# EasyEDA Pro project Power Switch.eprj

# Schematic Schematic1
Board Name: Board1; Drawed: MengYang
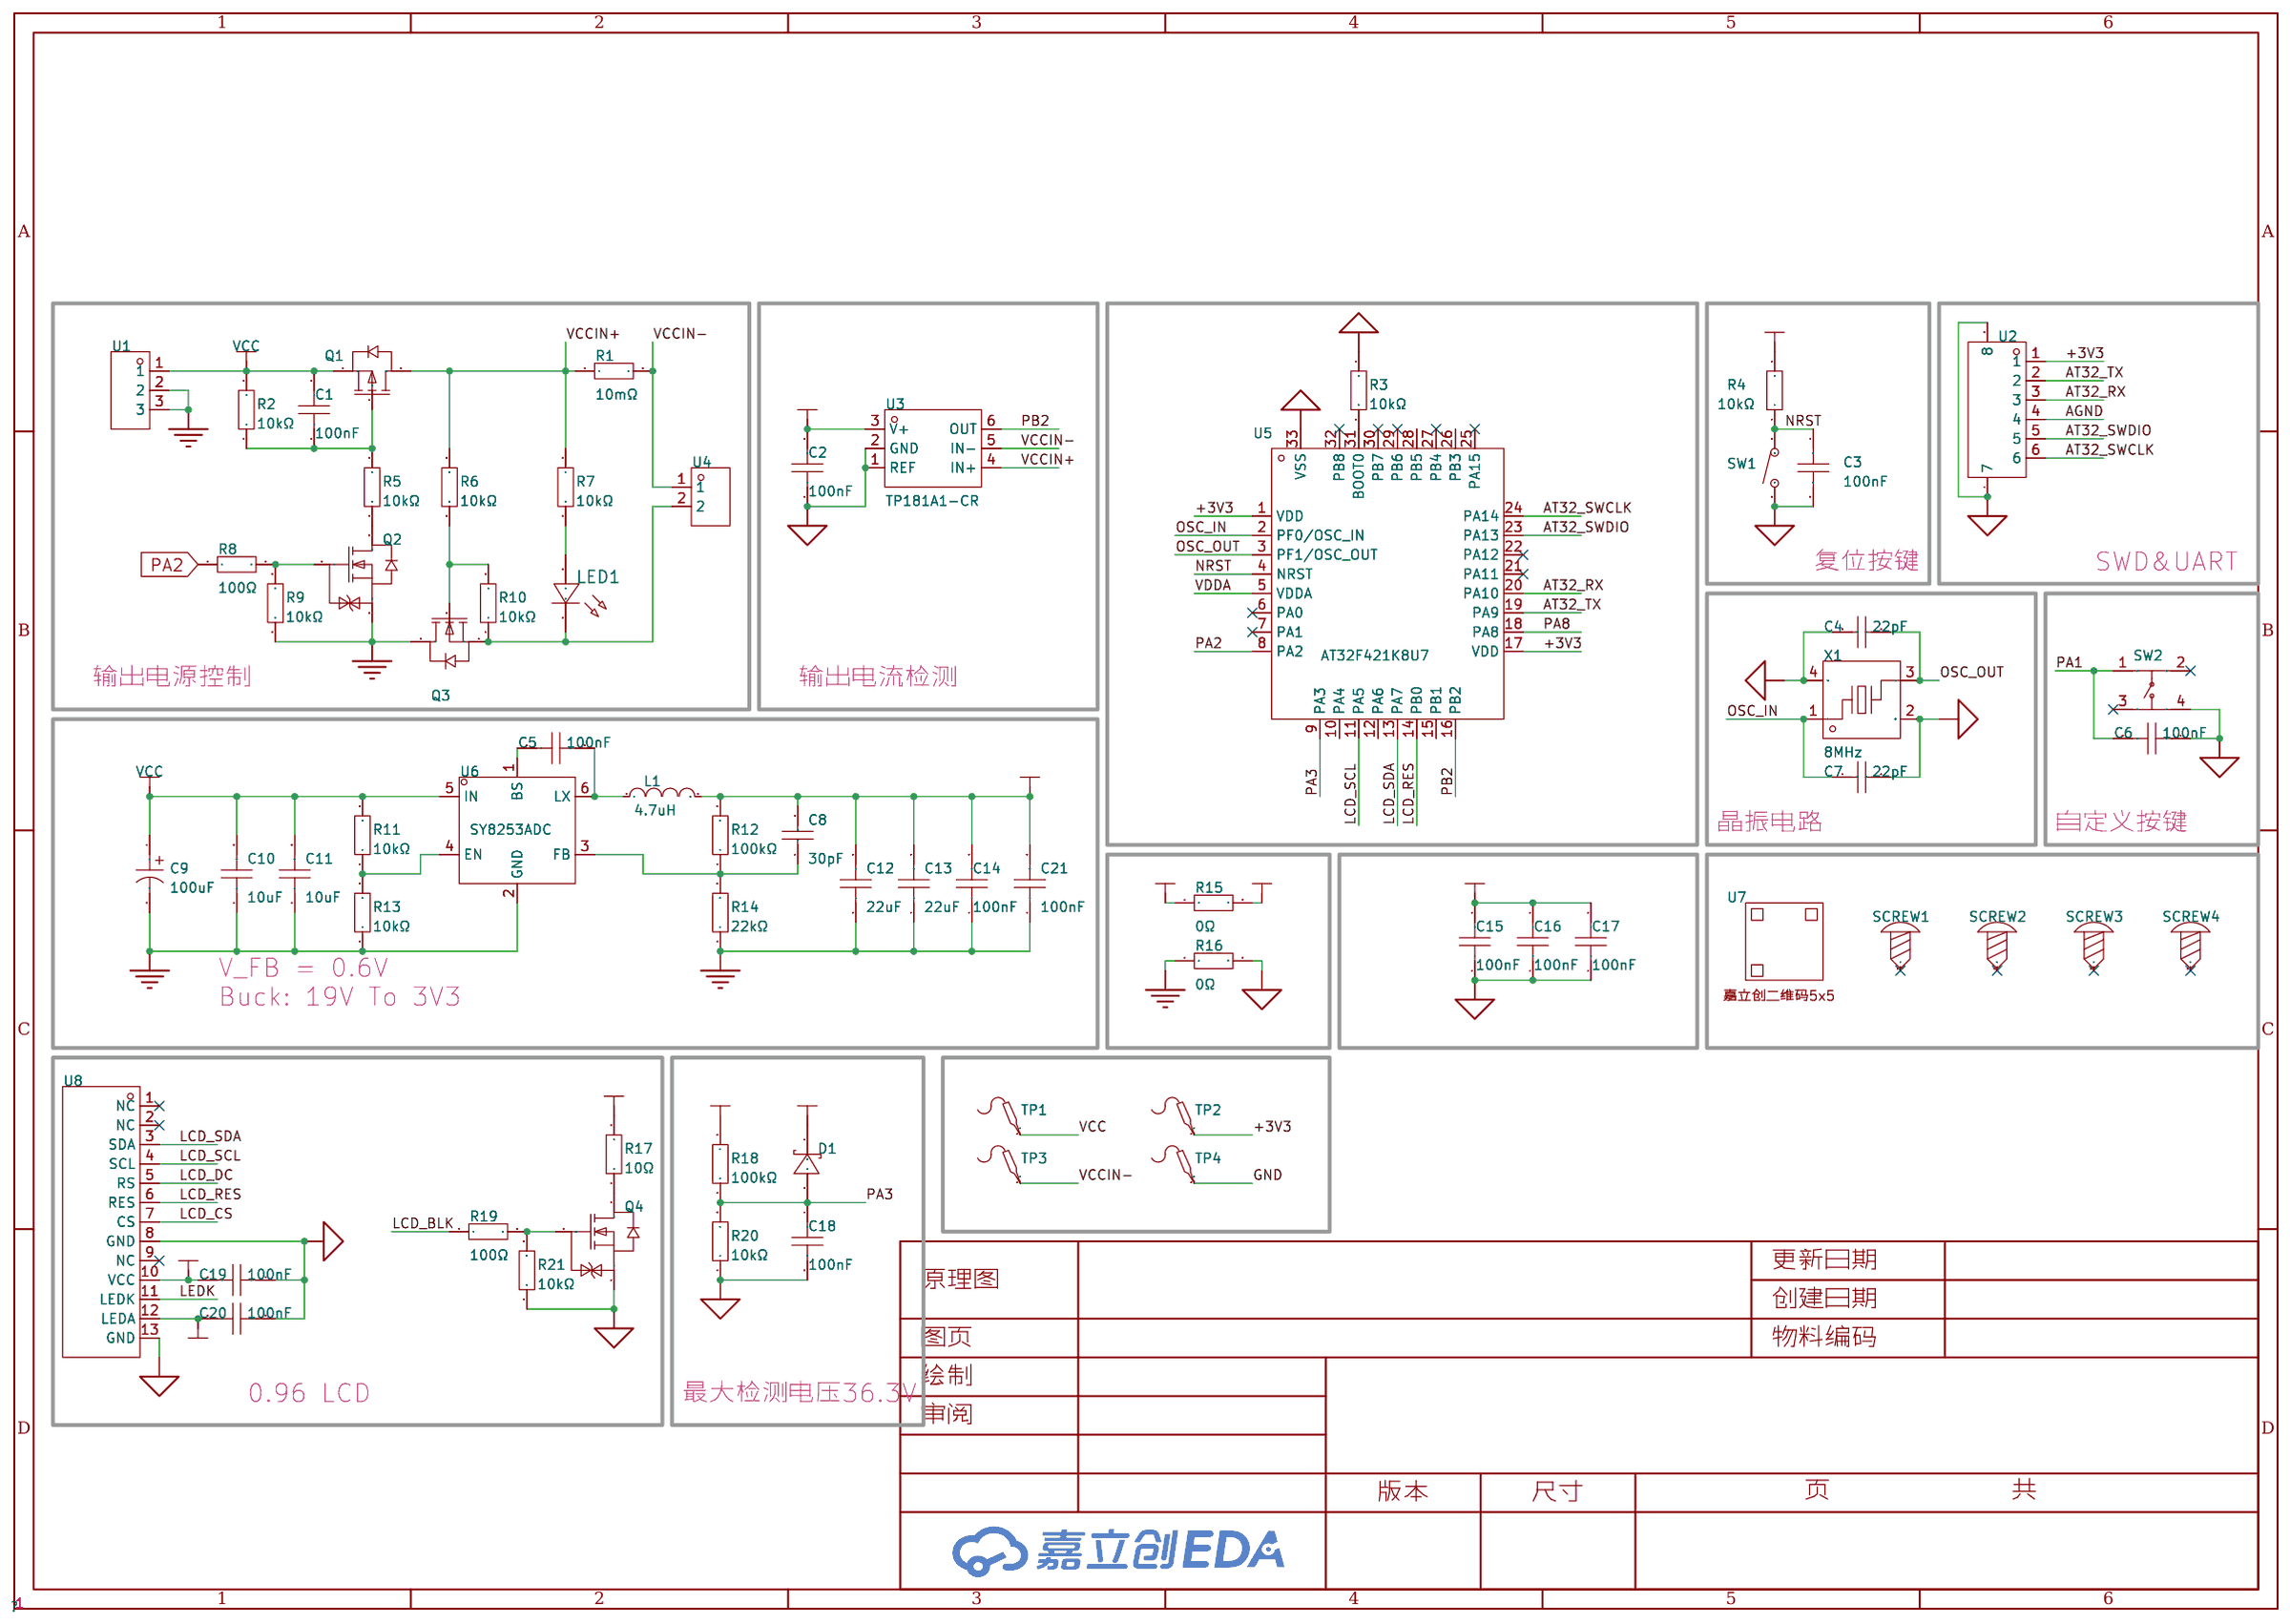
[diagram p0: schematic sheet]

## Parts
C1  100nF  [C0402]
C2  100nF  [C0402]
C3  100nF  [C0402]
C4  22pF  [C0402]
C5  100nF  [C0402]
C6  100nF  [C0402]
C7  22pF  [C0402]
C8  30pF  [C0402]
C9  100uF  [CAP-SMD_BD6.3-L6.6-W6.6-LS7.4-FD]
C10  10uF  [C0805]
C11  10uF  [C0805]
C12  22uF  [C0603]
C13  22uF  [C0603]
C14  100nF  [C0402]
C15  100nF  [C0402]
C16  100nF  [C0402]
C17  100nF  [C0402]
C18  100nF  [C0402]
C19  100nF  [C0402]
C20  100nF  [C0402]
C21  100nF  [C0402]
D1  SD103AWS  [SOD-323_L1.8-W1.3-LS2.5-RD]
L1  4.7uH  [IND-SMD_L5.4-W5.2_FXL0530]
LED1  -  [LED_0603]
Q1  NCE30P25S  [SOIC-8_L5.0-W4.0-P1.27-LS6.0-BL]
Q2  BR2N7002K2  [SOT-23-3_L2.9-W1.6-P1.90-LS2.8-BR]
Q3  NCEP4045GU  [DFN-8_L5.8-W4.9-P1.27-LS6.0-BL-1]
Q4  BR2N7002K2  [SOT-23-3_L2.9-W1.6-P1.90-LS2.8-BR]
R1  10mΩ  [R2512]
R2  10kΩ  [R0402]
R3  10kΩ  [R0402]
R4  10kΩ  [R0402]
R5  10kΩ  [R0402]
R6  10kΩ  [R0402]
R7  10kΩ  [R0402]
R8  100Ω  [R0402]
R9  10kΩ  [R0402]
R10  10kΩ  [R0402]
R11  10kΩ  [R0402]
R12  100kΩ  [R0402]
R13  10kΩ  [R0402]
R14  22kΩ  [R0402]
R15  0Ω  [R0402]
R16  0Ω  [R0402]
R17  10Ω  [R0402]
R18  100kΩ  [R0402]
R19  100Ω  [R0402]
R20  10kΩ  [R0402]
R21  10kΩ  [R0402]
SCREW1  -  [M2螺丝]  (no BOM)
SCREW2  -  [M2螺丝]  (no BOM)
SCREW3  -  [M2螺丝]  (no BOM)
SCREW4  -  [M2螺丝]  (no BOM)
SW1  TS-1185-B-A-B-A  [SW-SMD_L4.0-W3.0-LS5.0]
SW2  TS-1102S-B-C-B  [KEY-SMD_4P-L6.0-W6.0-P4.50-LS8.6]
TP1  -  [Test-Point-0.5mm]
TP2  -  [Test-Point-0.5mm]
TP3  -  [Test-Point-0.5mm]
TP4  -  [Test-Point-0.5mm]
U1  HC-DC-007B-2.5  [DC-IN-TH_HC-DC-007B-2.5]
U2  WAFER-GH1.25-6PWB  [CONN-SMD_6P-P1.25_XUNPU_WAFER-GH1.25-6PWB]
U3  TP181A1-CR  [SC70-6_L2.1-W1.3-P0.65-LS2.3-BL]
U4  KF301-5.0-2P  [CONN-TH_P5.00_KF301-5.0-2P]
U5  AT32F421K8U7  [QFN-32_L5.0-W5.0-P0.50-BL-EP3.4]
U6  SY8253ADC  [SOT-23-6_L2.9-W1.6-P0.95-LS2.8-BR]
U7  -  [JLC-QRCODE-5x5]  (no BOM)
U8  HS096T01H13  [LCD-SMD_HS096T01H13]
X1  8MHz  [OSC-SMD_4P-L3.2-W2.5-BL]

## Library data of the parts
C1-C3 C5 C6 C14-C21 = CL05B104KB54PNC: LCSC Part Name: 100nF ±10% 50V; Supplier Part: C307331; Manufacturer: SAMSUNG(三星); Supplier Footprint: 0402; JLCPCB Part Class: 基础库; Datasheet: https://atta.szlcsc.com/upload/public/pdf/source/20160218/1457707763339.pdf; Supplier: LCSC; Tolerance: ±10%; Voltage Rated: 50V; Temperature Coefficient: X7R
C4 C7 = 0402CG220J500NT: LCSC Part Name: 22pF ±5% 50V; Supplier Part: C1555; Manufacturer: FH(风华); Supplier Footprint: 0402; JLCPCB Part Class: 基础库; Datasheet: https://atta.szlcsc.com/upload/public/pdf/source/20200305/C486355_26A10D38EF8C2A5C37091D0039909270.pdf; Supplier: LCSC; Tolerance: ±5%; Voltage Rated: 50V; Temperature Coefficient: C0G
C8 = CC0402JRNPO9BN300: LCSC Part Name: 30pF ±5% 50V; Supplier Part: C107004; Manufacturer: YAGEO(国巨); Supplier Footprint: 0402; JLCPCB Part Class: 扩展库; Datasheet: https://atta.szlcsc.com/upload/public/pdf/source/20170914/C128857_1505359892143968080.pdf; Supplier: LCSC; Tolerance: ±5%; Voltage Rated: 50V; Temperature Coefficient: NP0
C9 = RVT100UF35V67RV0034: LCSC Part Name: 100uF ±20% 35V; Supplier Part: C2836442; Manufacturer: KNSCHA(科尼盛); Supplier Footprint: SMD,D6.3xL7.7mm; JLCPCB Part Class: 扩展库; Datasheet: https://atta.szlcsc.com/upload/public/pdf/source/20210528/C2836442_7F6389BF36F63F32D6DF3A507E8E95D6.pdf; Supplier: LCSC; Tolerance: ±20%; Rated Voltage: 35V; Ripple Current: 87mA@120kHz; φD: 6.3mm; L: 7.7mm; Lifetime @ Temp: 2000hrs@105℃; Operating Temperature: -55℃~+105℃
C10 C11 = CL21A106KAYNNNE_C15850: LCSC Part Name: 10uF ±10% 25V; Supplier Part: C15850; Manufacturer: SAMSUNG(三星); Manufacturer Part: CL21A106KAYNNNE; Supplier Footprint: 0805; JLCPCB Part Class: 基础库; Datasheet: https://atta.szlcsc.com/upload/public/pdf/source/20160218/1457707763339.pdf; Supplier: LCSC; Tolerance: ±10%; Voltage Rated: 25V; Temperature Coefficient: X5R
C12 C13 = CL10A226MQ8NRNC: LCSC Part Name: 22uF ±20% 6.3V; Supplier Part: C59461; Manufacturer: SAMSUNG(三星); Supplier Footprint: 0603; JLCPCB Part Class: 基础库; Datasheet: https://atta.szlcsc.com/upload/public/pdf/source/20160218/1457707763339.pdf; Supplier: LCSC; Tolerance: ±20%; Voltage Rated: 6.3V; Temperature Coefficient: X5R
D1 = SD103AWS_C181207: LCSC Part Name: 电压:40V 电流:350mA; Supplier Part: C181207; Manufacturer: Hottech(合科泰); Supplier Footprint: SOD-323; JLCPCB Part Class: 扩展库; Datasheet: https://atta.szlcsc.com/upload/public/pdf/source/20220428/0D2FA5652FCC4AF12D0418BE55C06B8A.pdf; Supplier: LCSC; Forward Voltage (Vf@If): 600mV@200mA; Reverse Voltage (Vr): 40V; Average Rectified Current (Io): 350mA
L1 = FXL0530-4R7-M: LCSC Part Name: 4.7uH ±20% 5A; Supplier Part: C177246; Manufacturer: cjiang(长江微电); Supplier Footprint: SMD,5.2x5.4mm; JLCPCB Part Class: 扩展库; Datasheet: https://atta.szlcsc.com/upload/public/pdf/source/20240426/3189EA8206330E2108542F9E34E540E7.pdf; Supplier: LCSC; Tolerance: ±20%; Rated Current: 4.5A; Saturation Current (Isat): 5A; DC Resistance (DCR): 60mΩ; Type: 一体成型电感
LED1 = LED_0603-R: Supplier Footprint: 0603
Q1 = NCE30P25S: 类型:1个P沟道;漏源电压(Vdss):30V;连续漏极电流(Id):25A;功率(Pd):3.5W;导通电阻(RDS(on)@Vgs,Id):9mΩ@10V,15A;阈值电压(Vgs(th)@Id):2.5V@250uA;; LCSC Part Name: 1个P沟道 耐压:30V 电流:25A; Supplier Part: C167517; Manufacturer: NCE(无锡新洁能); Supplier Footprint: SOIC-8; JLCPCB Part Class: 扩展库; Datasheet: https://atta.szlcsc.com/upload/public/pdf/source/20180329/C167517_14A30FD971841593E007DFD0589DD760.pdf; Supplier: LCSC; Type: 1个P沟道; Drain Source Voltage (Vdss): 30V; Continuous Drain Current (Id): 25A; Power Dissipation (Pd): 3.5W; Drain Source On Resistance (RDS(on)@Vgs,Id): 9mΩ@10V,15A; Gate Threshold Voltage (Vgs(th)@Id): 2.5V@250uA
Q2 Q4 = BR2N7002K2: 类型:1个N沟道;漏源电压(Vdss):60V;连续漏极电流(Id):300mA;功率(Pd):350mW;导通电阻(RDS(on)@Vgs,Id):1.7Ω@5V;阈值电压(Vgs(th)@Id):1.6V@250uA;; LCSC Part Name: 1个N沟道 耐压:60V 电流:300mA; Supplier Part: C358380; Manufacturer: BLUE ROCKET(蓝箭); Supplier Footprint: SOT-23; JLCPCB Part Class: 扩展库; Datasheet: https://atta.szlcsc.com/upload/public/pdf/source/20190129/C358380_0BB1AFEA822C683034D668672FCDA5F9.pdf; Supplier: LCSC; Type: 1个N沟道; Drain Source Voltage (Vdss): 60V; Continuous Drain Current (Id): 300mA; Power Dissipation (Pd): 350mW; Drain Source On Resistance (RDS(on)@Vgs,Id): 1.7Ω@5V; Gate Threshold Voltage (Vgs(th)@Id): 1.6V@250uA
Q3 = NCEP4045GU: 类型:1个N沟道;漏源电压(Vdss):40V;连续漏极电流(Id):45A;功率(Pd):28W;导通电阻(RDS(on)@Vgs,Id):6mΩ@10V,20A;阈值电压(Vgs(th)@Id):1.6V@250uA;; LCSC Part Name: 1个N沟道 耐压:40V 电流:45A; Supplier Part: C502973; Manufacturer: NCE(无锡新洁能); Supplier Footprint: DFN-8(4.9x5.8); JLCPCB Part Class: 扩展库; Datasheet: https://atta.szlcsc.com/upload/public/pdf/source/20220222/FD08EF86978BD853F9352D6B6A84BE91.pdf; Supplier: LCSC; Type: 1个N沟道; Drain Source Voltage (Vdss): 40V; Continuous Drain Current (Id): 45A; Power Dissipation (Pd): 28W; Drain Source On Resistance (RDS(on)@Vgs,Id): 6mΩ@10V,20A; Gate Threshold Voltage (Vgs(th)@Id): 1.6V@250uA; Total Gate Charge (Qg@Vgs): 17.6nC@10V; Input Capacitance (Ciss@Vds): 831pF@20V; Reverse Transfer Capacitance (Crss@Vds): 24pF@20V; Operating Temperature: -55℃~+150℃@(Tj)
R1 = FMF25FPJR010-LH_C105366: LCSC Part Name: 10mΩ ±1% 2W; Supplier Part: C105366; Manufacturer: PSA(信昌电陶); Manufacturer Part: FMF25FPJR010-LH; Supplier Footprint: 2512; JLCPCB Part Class: 扩展库; Datasheet: https://atta.szlcsc.com/upload/public/pdf/source/20191129/C464975_5F7F8E27A15B862FFEA0BACE05AA9473.pdf; Supplier: LCSC; Tolerance: ±1%; Power(Watts): 2W; Temperature Coefficient: ±70ppm/℃
R2-R7 R9-R11 R13 R20 R21 = 0402WGF1002TCE: LCSC Part Name: 10kΩ ±1% 62.5mW 厚膜电阻; Supplier Part: C25744; Manufacturer: UNI-ROYAL(厚声); Supplier Footprint: 0402; JLCPCB Part Class: 基础库; Datasheet: https://atta.szlcsc.com/upload/public/pdf/source/20200306/C422600_1E6D84923E4A46A82E41ADD87F860B5C.pdf; Supplier: LCSC; Type: 厚膜电阻; Tolerance: ±1%; Power(Watts): 62.5mW; Overload Voltage (Max): 50V; Temperature Coefficient: ±100ppm/℃; Operating Temperature Range: -55℃~+155℃
R8 R19 = 0402WGF1000TCE: 电阻类型:厚膜电阻;阻值:100Ω;精度:±1%;功率:62.5mW;最大工作电压:50V;温度系数:±200ppm/℃;; LCSC Part Name: 100Ω ±1% 62.5mW 厚膜电阻; Supplier Part: C25076; Manufacturer: UNI-ROYAL(厚声); Supplier Footprint: 0402; JLCPCB Part Class: 基础库; Datasheet: https://atta.szlcsc.com/upload/public/pdf/source/20200306/C422600_1E6D84923E4A46A82E41ADD87F860B5C.pdf; Supplier: LCSC; Type: 厚膜电阻; Tolerance: ±1%; Power(Watts): 62.5mW; Overload Voltage (Max): 50V; Temperature Coefficient: ±200ppm/℃; Operating Temperature Range: -55℃~+155℃
R12 R18 = 0402WGF1003TCE: LCSC Part Name: 100kΩ ±1% 62.5mW 厚膜电阻; Supplier Part: C25741; Manufacturer: UNI-ROYAL(厚声); Supplier Footprint: 0402; JLCPCB Part Class: 基础库; Datasheet: https://atta.szlcsc.com/upload/public/pdf/source/20200306/C422600_1E6D84923E4A46A82E41ADD87F860B5C.pdf; Supplier: LCSC; Type: 厚膜电阻; Tolerance: ±1%; Power(Watts): 62.5mW; Overload Voltage (Max): 50V; Temperature Coefficient: ±100ppm/℃; Operating Temperature Range: -55℃~+155℃
R14 = 0402WGF2202TCE: LCSC Part Name: 22kΩ ±1% 62.5mW 厚膜电阻; Supplier Part: C25768; Manufacturer: UNI-ROYAL(厚声); Supplier Footprint: 0402; JLCPCB Part Class: 基础库; Datasheet: https://atta.szlcsc.com/upload/public/pdf/source/20200306/C422600_1E6D84923E4A46A82E41ADD87F860B5C.pdf; Supplier: LCSC; Type: 厚膜电阻; Tolerance: ±1%; Power(Watts): 62.5mW; Overload Voltage (Max): 50V; Temperature Coefficient: ±100ppm/℃; Operating Temperature Range: -55℃~+155℃
R15 R16 = 0402WGF0000TCE: 电阻类型:厚膜电阻;阻值:0Ω;精度:±1%;功率:62.5mW;最大工作电压:50V;温度系数:±800ppm/℃;; LCSC Part Name: 0Ω ±1% 62.5mW 厚膜电阻; Supplier Part: C17168; Manufacturer: UNI-ROYAL(厚声); Supplier Footprint: 0402; JLCPCB Part Class: 基础库; Datasheet: https://atta.szlcsc.com/upload/public/pdf/source/20200306/C422600_1E6D84923E4A46A82E41ADD87F860B5C.pdf; Supplier: LCSC; Type: 厚膜电阻; Tolerance: ±1%; Power(Watts): 62.5mW; Overload Voltage (Max): 50V; Temperature Coefficient: ±800ppm/℃; Operating Temperature Range: -55℃~+155℃
R17 = 0402WGF100JTCE: 电阻类型:厚膜电阻;阻值:10Ω;精度:±1%;功率:62.5mW;最大工作电压:50V;温度系数:±200ppm/℃;; LCSC Part Name: 10Ω ±1% 62.5mW 厚膜电阻; Supplier Part: C25077; Manufacturer: UNI-ROYAL(厚声); Supplier Footprint: 0402; JLCPCB Part Class: 基础库; Datasheet: https://atta.szlcsc.com/upload/public/pdf/source/20200306/C422600_1E6D84923E4A46A82E41ADD87F860B5C.pdf; Supplier: LCSC; Type: 厚膜电阻; Tolerance: ±1%; Power(Watts): 62.5mW; Overload Voltage (Max): 50V; Temperature Coefficient: ±200ppm/℃; Operating Temperature Range: -55℃~+155℃
SCREW1-SCREW4 = M2螺丝: Supplier Footprint: 插件
SW1 = TS-1185-B-A-B-A: 电路结构:单刀单掷;按钮形状:圆形按钮;作用力:160gf;安装方式:立贴;开关长度:4mm;开关宽度:3mm;开关高度:2mm;带支架:不带;触点电流:50mA;额定电压(DC):12V;绝缘电阻:-;带灯:无;机械寿命:10万次;; LCSC Part Name: 4*3*2mm 立贴 轻触开关; Supplier Part: C561517; Manufacturer: XKB Connectivity(中国星坤); Supplier Footprint: SMD; JLCPCB Part Class: 扩展库; Datasheet: https://atta.szlcsc.com/upload/public/pdf/source/20211011/C2F26DC0AE1820400F54DBF49644F5A1.pdf; Supplier: LCSC; Circuit: 单刀单掷; Actuator Style: 圆形按钮; Operating Force: 160gf; Mounting Style: 立贴; Switch Length: 4mm; Switch Width: 3mm; Switch Height: 2mm; Strike Gundam: 不带; Contact Current: 50mA; Voltage Rating (DC): 12V; Actuator/Cap Color: 黑色; With Lamp: 无; Mechanical Life: 10万次; Operating Temperature: -30℃~+85℃
SW2 = TS-1102S-B-C-B: LCSC Part Name: 6*6*5mm 立贴 轻触开关; Supplier Part: C480271; Manufacturer: XKB Connectivity(中国星坤); Supplier Footprint: SMD; JLCPCB Part Class: 扩展库; Datasheet: https://atta.szlcsc.com/upload/public/pdf/source/20211011/2711A6933F86C308D94098377C07E7B1.pdf; Supplier: LCSC; Circuit: 单刀单掷; Actuator Style: 圆形按钮; Operating Force: 160gf; Mounting Style: 立贴; Switch Length: 6mm; Switch Width: 6mm; Switch Height: 5mm; Strike Gundam: 不带; Contact Current: 50mA; Voltage Rating (DC): 12V; Actuator/Cap Color: 黑色; With Lamp: 无; Mechanical Life: 30万次; Operating Temperature: -20℃~+70℃
TP1-TP4 = Test-Point
U1 = HC-DC-007B-2.5: LCSC Part Name: DC电源插座 内径:2.5mm 外径:6.45mm; Supplier Part: C3010538; Manufacturer: HCTL(华灿天禄); Supplier Footprint: 插件; JLCPCB Part Class: 扩展库; Datasheet: https://atta.szlcsc.com/upload/public/pdf/source/20230915/8C7BE09142C4C7906C99972591413B87.pdf; Supplier: LCSC; Connector Type: DC电源插座; Mounting Style: 弯插; Inside Contact Diameter: 2.5mm; Outside Contact Diameter: 6.45mm; Current Rating (Max): 8A; Voltage Rating (Max): 24V; Contact Material: 黄铜; Contact Plating: 锡; Operating Temperature Range: -30℃~+70℃
U2 = WAFER-GH1.25-6PWB: 插针结构:1x6P;间距:1.25mm;安装方式:卧贴;参考系列:GH;总PIN数:6P;排数:1;每排PIN数:6;额定电流:1A;工作温度范围:-25℃~+85℃;; LCSC Part Name: 1x6P 间距:1.25mm 卧贴 系列:GH; Supplier Part: C3029381; Manufacturer: XUNPU(讯普); Supplier Footprint: SMD,P=1.25mm,卧贴; JLCPCB Part Class: 扩展库; Datasheet: https://atta.szlcsc.com/upload/public/pdf/source/20220527/CB8773BFB0913C3B8ABD62CB38BA101A.pdf; Supplier: LCSC; Pins Structure: 1x6P; Pitch: 1.25mm; Mounting Style: 卧贴; Reference Series: GH; Number of Pins: 6P; Number of Rows: 1; Number of PINs Per Row: 6; Current Rating (Max): 1A; Operating Temperature Range: -25℃~+85℃
U3 = TP181A1-CR: Supplier Part: C2902349; Manufacturer: 3PEAK; Supplier Footprint: SC70-6; JLCPCB Part Class: 扩展库; Datasheet: https://atta.szlcsc.com/upload/public/pdf/source/20230301/6D62DABF8769A8088870FFE026FF2C6D.pdf; Supplier: LCSC
U4 = KF301-5.0-2P: 结构:1x2P;间距:5mm;颜色:蓝色;安装方式:直插;额定电流:17A;额定电压:250V;排数:1;线规 - AWG:14~22;线规 - 平方毫米:1.5;每排PIN数:2;工作温度范围:-30℃~+120℃;; LCSC Part Name: 5mm 1x2P 排数:1 每排P数:2 直插; Supplier Part: C474881; Manufacturer: KEFA(科发); Supplier Footprint: 插件,P=5mm; JLCPCB Part Class: 扩展库; Datasheet: https://atta.szlcsc.com/upload/public/pdf/source/20230317/03A5B5FC229D6F9225E8F51DA1A4E80A.pdf; Supplier: LCSC; Structure: 1x2P; Pitch: 5mm; Color: 蓝色; Mounting Style: 直插; Current Rating (Max): 17A; Voltage Rating (Max): 250V; Number of Pins: 2P; Number of Rows: 1; Wire Gauge - AWG: 14~22; Wire Gauge - mm2: 1.5; Number of PINs Per Row: 2; Operating Temperature Range: -30℃~+120℃
U5 = AT32F421K8U7: Supplier Part: C2965611; Manufacturer: ARTERY(雅特力); Supplier Footprint: QFN-32; JLCPCB Part Class: 扩展库; Supplier: LCSC
U6 = SY8253ADC: 功能类型:降压型;输入电压:-;输出电流(最大值):-;; Supplier Part: F; Manufacturer: silergy(矽力杰); Supplier Footprint: SOT-23-6; JLCPCB Part Class: 扩展库; Datasheet: https://atta.szlcsc.com/upload/public/pdf/source/20180625/C93736_E75EC6FD4320D65590D2D5BF0D8B8959.pdf; Supplier: LCSC; Function: 降压型; Switch tube (built-in/external): 内置
U7 = 嘉立创二维码5x5
U8 = HS096T01H13: 主控芯片:ST7735;尺寸(inch):0.96;; LCSC Part Name: 0.96寸 0.96寸80x160(RGB)彩色SPI串口TFT液晶显示屏; Supplier Part: C18198246; Manufacturer: HS(汉昇); JLCPCB Part Class: Extended Part; Datasheet: https://atta.szlcsc.com/upload/public/pdf/source/20230921/67AD52EDFD5E8BFFA1AE424F3A3F761A.pdf; Supplier: LCSC; Main Control Chip: ST7735; Size: 0.96; Operating Temperature: -20℃~+70℃
X1 = X32258MOB4SI: LCSC Part Name: 8MHz ±10ppm 12pF; Supplier Part: C2682775; Manufacturer: YXC(扬兴晶振); Supplier Footprint: SMD3225-4P; JLCPCB Part Class: 扩展库; Datasheet: https://atta.szlcsc.com/upload/public/pdf/source/20240329/19D5F850207469550BEB00D7DFEDBC7A.pdf; Supplier: LCSC; Crystal Type: 贴片晶振; Normal temperature Frequency Tolerance: ±10ppm; External load capacitor: 12pF; Frequency Stability(Full temperature range): ±20ppm; Equivalent Series Resistance (ESR): 150Ω; Operating Temperature: -40℃~+85℃

## Nets
+3V3: C2.2 C8.2 C12.2 C13.2 C14.2 C15.2 C16.2 C17.2 C19.2 C20.2 C21.2 D1.1(C) L1.2 R4.2 R12.2 R15.1 TP2.1 U2.1 U3.3(V+) U5.1(VDD) U5.17(VDD) U8.10(VCC) U8.12(LEDA)
AGND: C2.1 C3.2 C4.1 C6.1 C7.2 C15.1 C16.1 C17.1 C18.2 C19.1 C20.1 Q4.2(S) R3.1 R16.2 R20.1 R21.1 SW1.2 SW2.4 U2.4 U2.7 U2.8 U3.1(REF) U3.2(GND) U5.33(VSS) U8.8(GND) U8.13(GND) X1.2(GND) X1.4(GND)
GND: C9.2 C10.1 C11.1 C12.1 C13.1 C14.1 C21.1 Q2.2(S) Q3.3(D) R9.1 R13.1 R14.1 R16.1 TP4.1 U1.2 U1.3 U6.2(GND)
VCC: C1.2 C9.1 C10.2 C11.2 Q1.3(S) R2.2 R11.2 TP1.1 U1.1 U6.5(IN)
VCCIN+: Q1.2(D) R1.1 R6.2 R7.2 U3.4(IN+)
VCCIN-: R1.2 R18.2 TP3.1 U3.5(IN-) U4.1
VDDA: R15.2 U5.5(VDDA)
AT32_RX: U2.3 U5.20(PA10)
AT32_SWCLK: U2.6 U5.24(PA14)
AT32_SWDIO: U2.5 U5.23(PA13)
AT32_TX: U2.2 U5.19(PA9)
LCD_BLK: R19.1
LCD_CS: U8.7(CS)
LCD_DC: U8.5(RS)
LCD_RES: U5.14(PB0) U8.6(RES)
LCD_SCL: U5.11(PA5) U8.4(SCL)
LCD_SDA: U5.13(PA7) U8.3(SDA)
LEDK: R17.2 U8.11(LEDK)
NRST: C3.1 R4.1 SW1.1 U5.4(NRST)
OSC_IN: C7.1 U5.2(PF0/OSC_IN) X1.1
OSC_OUT: C4.2 U5.3(PF1/OSC_OUT) X1.3
PA1: C6.2 SW2.1
PA2: R8.1 U5.8(PA2)
PA3: C18.1 D1.2(A) R18.1 R20.2 U5.9(PA3)
PA8: U5.18(PA8)
PB2: U3.6(OUT) U5.16(PB2)
$1N3514: C5.1 U6.1(BS)
$1N3518: C5.2 L1.1 U6.6(LX)
$1N3743: C8.1 R12.1 R14.2 U6.3(FB)
$1N4987: R11.1 R13.2 U6.4(EN)
$1N9912: Q3.1(G) R6.1 R10.2
$1N10537: C1.1 Q1.1(G) R2.1 R5.2
$1N10666: Q2.3(D) R5.1
$1N10742: Q2.1(G) R8.2 R9.2
$1N11033: LED1.2(A) R7.1
$1N11315: LED1.1(C) Q3.2(S) R10.1 U4.2
$1N15037: Q4.1(G) R19.2 R21.2
$1N15095: Q4.3(D) R17.1
$1N30434: R3.2 U5.31(BOOT0)

Not connected (* = marked no-connect by the designer): SCREW1 1*; SCREW2 1*; SCREW3 1*; SCREW4 1*; SW2 2* 3*; U5 6(PA0)* 7(PA1)* 10(PA4) 12(PA6) 15(PB1) 21(PA11)* 22(PA12)* 25(PA15)* 26(PB3) 27(PB4)* 28(PB5) 29(PB6)* 30(PB7)* 32(PB8)*; U8 1(NC)* 2(NC)* 9(NC)*

## Notes on the sheet
- 复位按键
- SWD&UART
- 输出电源控制
- 输出电流检测
- 晶振电路
- 自定义按键
- V_FB = 0.6V
  Buck: 19V To 3V3
- 0.96 LCD
- 最大检测电压36.3V

# Board PCB1
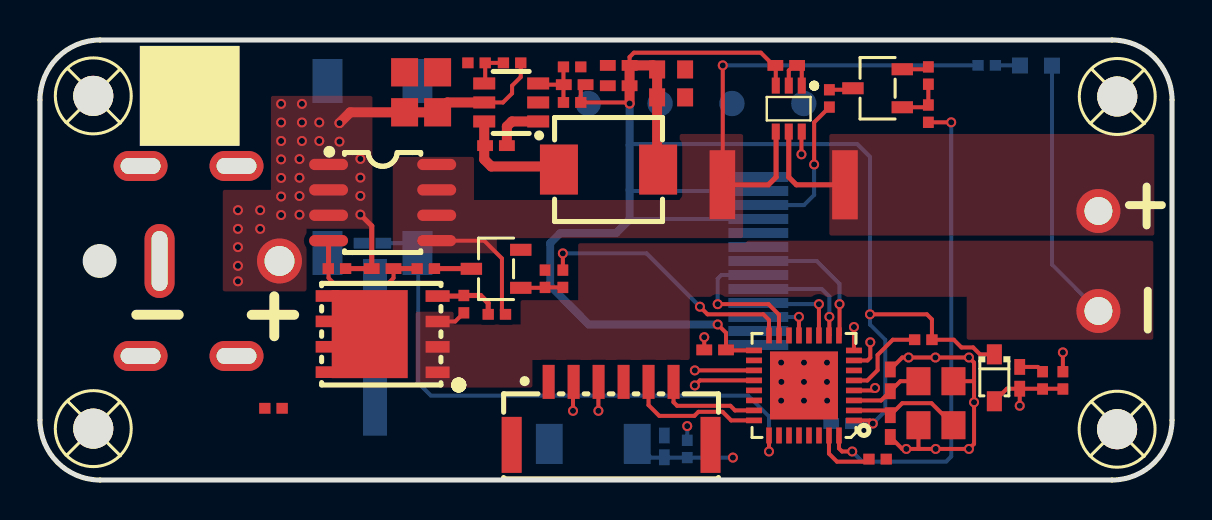
[diagram p1: board, top side]
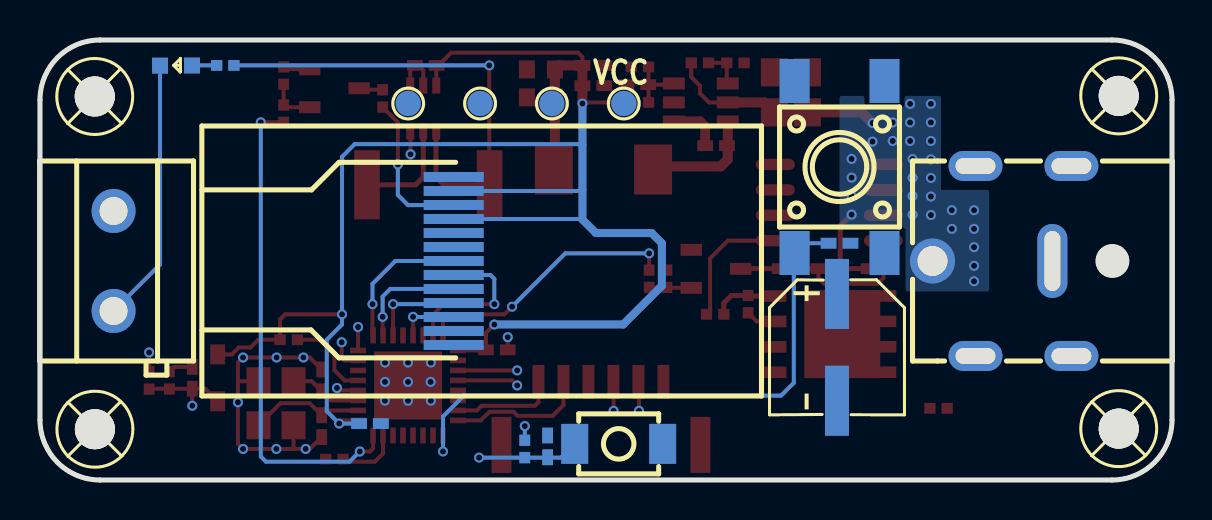
[diagram p2: board, bottom side, seen from below]

Outline 56.64 x 22 mm; copper layers: Top Layer, Inner1, Inner2, Bottom Layer. Coordinates in mm from the lower left corner of the outline.
Outline path: 0,19 0,3 arc(0.88,0.88) 3,0 53.64,0 arc(55.76,0.88) 56.64,3 56.64,19 arc(55.76,21.12) 53.64,22 3,22 arc(0.88,21.12) 0,19
Stack: Top Layer 0.035mm 外层铜厚1oz / Dielectric1 0.2104mm 7628 RC49% 8.6mil / Inner1 0.0152mm 内层铜厚 / Dielectric2 1.065mm 1.1mm H/HOZ Copper / Inner2 0.0152mm 内层铜厚 / Dielectric3 0.2104mm 7628 RC49% 8.6mil / Bottom Layer 0.035mm 外层铜厚1oz

## Design rules (mm)
template: 自定义配置
spacing copperThickness1oz (default): track to track 0.102, other pairs 0.152 to 0.3
spacing copperThickness2oz: track to track 0.203, other pairs 0.152 to 0.3
track width copperThickness1oz (default): min 0.127, default 0.201, max 2.54
track width copperThickness2oz: min 0.203, default 0.254, max 2.54
differential pair differentialPair (default): width min 0.127, default 0.254, max 2.54; gap min 0.152, default 0.152
via viaSize (default): diameter min 0.5, default 0.5, max 10; hole min 0.3, default 0.305, max 6.299

## Placement (name value [footprint] x y rotation side)
C1  100nF  [C0402]  17.14 10.57 180 top
C2  100nF  [C0402]  37.34 20.73 180 top
C3  100nF  [C0402]  31.24 1.68 90 bottom
C4  22pF  [C0402]  42.55 4.98 270 top
C5  100nF  [C0402]  22.82 16.72 180 top
C6  100nF  [C0402]  16.64 11.84 0 bottom
C7  22pF  [C0402]  42.55 2.7 270 top
C8  30pF  [C0402]  26.75 19.77 0 top
C9  100uF  [CAP-SMD_BD6.3-L6.6-W6.6-LS7.4-FD]  16.76 6.63 270 bottom
C10  10uF  [C0805]  19.89 19.38 270 top
C11  10uF  [C0805]  18.24 19.38 270 top
C12  22uF  [C0603]  31.58 20.53 180 top
C13  22uF  [C0603]  31.58 19.13 180 top
C14  100nF  [C0402]  28.96 20.73 0 top
C15  100nF  [C0402]  40.13 2.82 0 bottom
C16  100nF  [C0402]  33.78 6.51 0 top
C18  100nF  [C0402]  49.02 5.11 90 top
C21  100nF  [C0402]  28.96 19.71 0 top
D1  SD103AWS  [SOD-323_L1.8-W1.3-LS2.5-RD]  47.75 5.11 270 top
L1  4.7uH  [IND-SMD_L5.4-W5.2_FXL0530]  28.45 15.52 0 top
LED1  -  [LED_0603]  49.78 20.73 180 bottom
Q1  NCE30P25S  [SOIC-8_L5.0-W4.0-P1.27-LS6.0-BL]  17.14 13.87 270 top
Q2  BR2N7002K2  [SOT-23-3_L2.9-W1.6-P1.90-LS2.8-BR]  22.82 10.56 0 top
Q3  NCEP4045GU  [DFN-8_L5.8-W4.9-P1.27-LS6.0-BL-1]  17.14 7.29 90 top
Q4  BR2N7002K2  [SOT-23-3_L2.9-W1.6-P1.90-LS2.8-BR]  41.91 19.59 0 top
R1  10mΩ  [R2512]  37.21 14.76 0 top
R2  10kΩ  [R0402]  14.86 10.57 0 top
R3  10kΩ  [R0402]  41.91 1.05 180 top
R4  10kΩ  [R0402]  32.39 1.55 90 bottom
R5  10kΩ  [R0402]  19.3 10.57 180 top
R6  10kΩ  [R0402]  22.86 8.28 0 top
R7  10kΩ  [R0402]  47.37 20.73 180 bottom
R8  100Ω  [R0402]  26.16 10.06 270 top
R9  10kΩ  [R0402]  25.27 10.06 270 top
R10  10kΩ  [R0402]  21.21 8.79 90 top
R11  10kΩ  [R0402]  23.62 20.86 0 top
R12  100kΩ  [R0402]  26.63 18.88 0 top
R13  10kΩ  [R0402]  21.84 20.86 0 top
R14  22kΩ  [R0402]  26.63 20.66 180 top
R15  0Ω  [R0402]  44.2 7.01 180 top
R16  0Ω  [R0402]  11.68 3.58 0 top
R17  10Ω  [R0402]  39.5 19.08 270 top
R18  100kΩ  [R0402]  51.18 4.98 90 top
R19  100Ω  [R0402]  44.45 18.32 90 top
R20  10kΩ  [R0402]  50.17 4.98 270 top
R21  10kΩ  [R0402]  44.45 20.22 270 top
SCREW1  -  [M2螺丝]  53.89 2.54 0 top
SCREW2  -  [M2螺丝]  53.9 19.18 0 top
SCREW3  -  [M2螺丝]  2.67 2.57 0 top
SCREW4  -  [M2螺丝]  2.67 19.21 0 top
SW1  TS-1185-B-A-B-A  [SW-SMD_L4.0-W3.0-LS5.0]  27.69 1.81 180 bottom
SW2  TS-1102S-B-C-B  [KEY-SMD_4P-L6.0-W6.0-P4.50-LS8.6]  16.64 15.65 90 bottom
TP1  -  [Test-Point-0.5mm]  27.43 18.82 180 bottom
TP2  -  [Test-Point-0.5mm]  31.03 18.82 180 bottom
TP3  -  [Test-Point-0.5mm]  38.22 18.82 180 bottom
TP4  -  [Test-Point-0.5mm]  34.62 18.82 180 bottom
U1  HC-DC-007B-2.5  [dc-in-th_hc-dc-007b-2.5]  8.51 10.95 0 bottom
U2  WAFER-GH1.25-6PWB  [CONN-SMD_6P-P1.25_XUNPU_WAFER-GH1.25-6PWB]  28.58 3.33 0 top
U3  TP181A1-CR  [SC70-6_L2.1-W1.3-P0.65-LS2.3-BL]  37.47 18.57 180 top
U4  KF301-5.0-2P  [CONN-TH_P5.00_KF301-5.0-2P]  52.96 10.95 270 bottom
U5  AT32F421K8U7  [QFN-32_L5.0-W5.0-P0.50-BL-EP3.4]  38.23 4.73 90 top
U6  SY8253ADC  [SOT-23-6_L2.9-W1.6-P0.95-LS2.8-BR]  23.58 18.88 0 top
U7  -  [JLC-QRCODE-5x5]  7.49 19.21 0 top
U8  HS096T01H13  [LCD-SMD_HS096T01H13]  35.94 10.95 0 bottom
X1  8MHz  [OSC-SMD_4P-L3.2-W2.5-BL]  44.83 3.84 90 top

## Footprints (pads in the part's own frame, mm; a bottom-side part is the same pattern mirrored in y, then rotated)
C0402
  rect 0.79x0.54 smd: 1(-0.545,0) 2(0.545,0)
C0603
  rect 0.8x0.9 smd: 1(-0.7,0) 2(0.7,0)
C0805
  rect 1.41x1.35 smd: 1(-1,0) 2(1,0)
CAP-SMD_BD6.3-L6.6-W6.6-LS7.4-FD
  rect 3.5x1.2 smd: 1(-2.67,0) 2(2.67,0)
CONN-SMD_6P-P1.25_XUNPU_WAFER-GH1.25-6PWB
  rect 0.6x1.7 smd: 1(-3.125,1.575) 2(-1.875,1.575) 3(-0.625,1.575) 4(0.625,1.575) 5(1.875,1.575) 6(3.125,1.575)
  rect 1x2.8 smd: 7(4.975,-1.575) 8(-4.975,-1.575)
CONN-TH_P5.00_KF301-5.0-2P
  round 2.2 hole 1.4: 1(-2.5,0) 2(2.5,0)
dc-in-th_hc-dc-007b-2.5
  round 2.25 hole 1.5: 1(3.475,0)
  oval 1.5x3.7 hole 0.8x2.999: 2(-2.525,0)
  oval 2.7x1.5 hole 2x0.8: 3(-3.475,-4.75) 3(-3.475,4.75) 3(1.325,-4.75) 3(1.325,4.75)
DFN-8_L5.8-W4.9-P1.27-LS6.0-BL-1
  rect 0.58x1.2 smd: 1(1.903,-2.75) 2(-1.907,-2.75) 2(-0.637,-2.75) 2(0.632,-2.75) 3(-1.903,2.75) 3(-0.632,2.75) 3(0.637,2.75) 3(1.907,2.75)
  rect 4.4x3.8 smd: 3(0,0.646)
IND-SMD_L5.4-W5.2_FXL0530
  rect 1.9x2.5 smd: 1(-2.482,0) 2(2.482,0)
KEY-SMD_4P-L6.0-W6.0-P4.50-LS8.6
  rect 2.2x1.5 smd: 1(-4.3,2.25) 2(4.3,2.25) 3(-4.3,-2.25) 4(4.3,-2.25)
LCD-SMD_HS096T01H13
  rect 3x0.5 smd: 1(0,4.2) 2(0,3.5) 3(0,2.8) 4(0,2.1) 5(0,1.4) 6(0,0.7) 7(0,0) 8(0,-0.7) 9(0,-1.4) 10(0,-2.1) 11(0,-2.8) 12(0,-3.5) 13(0,-4.2)
LED_0603
  rect 0.8x0.8 smd: 1(-0.851,-0.01) 2(0.75,-0.005)
M2螺丝
  round 2 hole 2: 1(0,0)
OSC-SMD_4P-L3.2-W2.5-BL
  rect 1.4x1.2 smd: 1(-1.1,-0.875) 2(1.1,-0.875) 3(1.1,0.875) 4(-1.1,0.875)
QFN-32_L5.0-W5.0-P0.50-BL-EP3.4
  rect 0.28x0.8 smd: 1(-1.75,-2.5) 2(-1.252,-2.5) 3(-0.751,-2.5) 4(-0.252,-2.5) 5(0.248,-2.5) 6(0.749,-2.5) 7(1.248,-2.5) 8(1.748,-2.5) 17(1.752,2.5) 18(1.252,2.5) 19(0.751,2.5) 20(0.252,2.5) 21(-0.248,2.5) 22(-0.749,2.5) 23(-1.248,2.5) 24(-1.748,2.5)
  rect 0.8x0.28 smd: 9(2.5,-1.748) 10(2.5,-1.248) 11(2.5,-0.748) 12(2.5,-0.248) 13(2.5,0.252) 14(2.5,0.752) 15(2.5,1.252) 16(2.5,1.752) 25(-2.5,1.75) 26(-2.5,1.25) 27(-2.5,0.75) 28(-2.5,0.25) 29(-2.5,-0.25) 30(-2.5,-0.75) 31(-2.5,-1.25) 32(-2.5,-1.75)
  rect 3.4x3.4 smd: 33(0,0)
R0402
  rect 0.566x0.54 smd: 1(-0.433,0) 2(0.433,0)
R2512
  rect 1.282x3.456 smd: 1(-3.067,0) 2(3.067,0)
SC70-6_L2.1-W1.3-P0.65-LS2.3-BL
  rect 0.4x0.8 smd: 1(-0.65,-1.15) 2(-0.001,-1.15) 3(0.65,-1.15) 4(0.65,1.15) 5(0,1.15) 6(-0.65,1.15)
SOD-323_L1.8-W1.3-LS2.5-RD
  rect 1x0.75 smd: 1(-1.173,0) 2(1.173,0)
SOIC-8_L5.0-W4.0-P1.27-LS6.0-BL
  oval 0.569x1.95 smd: 1(1.905,-2.705) 2(-1.905,2.705) 2(-0.635,2.705) 2(0.635,2.705) 2(1.905,2.705) 3(-1.905,-2.705) 3(-0.635,-2.705) 3(0.635,-2.705)
SOT-23-3_L2.9-W1.6-P1.90-LS2.8-BR
  rect 1.07x0.6 smd: 1(1.235,-0.95) 2(1.235,0.95) 3(-1.235,0)
SOT-23-6_L2.9-W1.6-P0.95-LS2.8-BR
  rect 1.1x0.6 smd: 1(1.35,-0.95) 2(1.35,0) 3(1.35,0.95) 4(-1.35,0.95) 5(-1.35,0) 6(-1.35,-0.95)
SW-SMD_L4.0-W3.0-LS5.0
  rect 1.35x2 smd: 1(-2.2,0) 2(2.2,0)
Test-Point-0.5mm
  round 1.27 smd: 1(0,0)

## Nets
+3V3: C2.2 C8.2 C12.2 C13.2 C14.2 C15.2 C16.2 C21.2 D1.1 L1.2 R4.2 R12.2 R15.1 TP2.1 U2.1 U3.3 U5.1 U5.17 U8.10 U8.12
AGND: C2.1 C3.2 C4.1 C6.1 C7.2 C15.1 C16.1 C18.2 Q4.2 R3.1 R16.2 R20.1 R21.1 SW1.2 SW2.4 U2.4 U2.7 U2.8 U3.1 U3.2 U5.33 U8.8 U8.13 X1.2 X1.4
GND: C9.2 C10.1 C11.1 C12.1 C13.1 C14.1 C21.1 Q2.2 Q3.3 R9.1 R13.1 R14.1 R16.1 TP4.1 U1.2 U1.3 U6.2
VCC: C1.2 C9.1 C10.2 C11.2 Q1.3 R2.2 R11.2 TP1.1 U1.1 U6.5
VCCIN+: Q1.2 R1.1 R6.2 R7.2 U3.4
VCCIN-: R1.2 R18.2 TP3.1 U3.5 U4.1
VDDA: R15.2 U5.5
AT32_RX: U2.3 U5.20
AT32_SWCLK: U2.5 U5.24
AT32_SWDIO: U2.6 U5.23
AT32_TX: U2.2 U5.19
LCD_BLK: R19.1 U5.32
LCD_CS: U5.9 U8.7
LCD_DC: U5.10 U8.5
LCD_RES: U5.15 U8.6
LCD_SCL: U5.11 U8.4
LCD_SDA: U5.13 U8.3
LEDK: R17.2 U8.11
NRST: C3.1 R4.1 SW1.1 U5.4
OSC_IN: C7.1 U5.2 X1.1
OSC_OUT: C4.2 U5.3 X1.3
PA0: U5.6
PA1: C18.1 D1.2 R18.1 R20.2 U5.7
PA2: U3.6 U5.8
PA6: U5.12
PA15: C6.2 SW2.1 U5.25
PB0: U5.14
PB2: R8.1 U5.16
$1N3514: C5.1 U6.1
$1N3518: C5.2 L1.1 U6.6
$1N3743: C8.1 R12.1 R14.2 U6.3
$1N4987: R11.1 R13.2 U6.4
$1N9912: Q3.1 R6.1 R10.2
$1N10537: C1.1 Q1.1 R2.1 R5.2
$1N10666: Q2.3 R5.1
$1N10742: Q2.1 R8.2 R9.2
$1N11033: LED1.2 R7.1
$1N11315: LED1.1 Q3.2 R10.1 U4.2
$1N15037: Q4.1 R19.2 R21.2
$1N15095: Q4.3 R17.1
$1N30434: R3.2 U5.31

Pads without a net: SCREW1 1; SCREW2 1; SCREW3 1; SCREW4 1; SW2 2 3; U5 18 21 22 26 27 28 29 30; U8 1 2 9

## Via types
v1: diameter 0.5, hole 0.305, Top Layer to Bottom Layer, 74 vias

## Routing (per net, layer and track width the routed paths; a pad name or vN(x,y) marks a point on that pad's centre or on a via; arc(x,y) is an arc through that point)
+3V3: length 100.6
  Top Layer w0.201: C8.2 27.06,19.53 27.06,18.88 29.45,18.88 v1(29.5,18.82) ; v1(41.67,2.82) 41.67,2.84 41.53,2.98 U5.1 ; C14.2 29.5,21.15 29.72,21.36 36.07,21.36 36.7,20.73 C2.2 36.82,20.71 U3.3 ; D1.1 47.04,6.28 46.69,6.63 46.11,6.63 45.72,7.01 R15.1 44.63,8.03 44.38,8.28 v1(41.53,8.28) ; U5.17 34.35,6.48 C16.2 34.33,7.36 v1(33.91,7.78)
  Top Layer w0.5: v1(29.5,18.82) C21.2 C14.2 30.68,20.73 C12.2 C13.2 30.88,15.57 L1.2
  Inner1 w0.201: v1(33.91,7.78) 33.91,4.22 v1(32.39,2.7)
  Bottom Layer w0.201: U8.12 29.55,14.45 29.5,14.5 ; 29.5,13.02 29.53,13.05 U8.10 ; R4.2 v1(32.39,2.7) ; C15.2 v1(41.67,2.82) 42.29,3.44 42.29,7.01 41.53,7.78 v1(41.53,8.28) 41.53,16.16 40.89,16.79 29.55,16.79 29.5,16.74
  Bottom Layer w0.4: v1(29.5,18.82) 29.5,13.02 28.82,12.35 26.04,12.35 25.53,11.84 25.53,9.71 27.46,7.78 v1(33.91,7.78)
AGND: length 21
  Top Layer w0.201: 43.98,1.55 v1(44.82,1.55) v1(46.48,1.55) 46.74,1.81 v1(46.74,3.89) 46.74,4.95 ; 43.98,1.55 43.14,1.55 C7.2 ; 43.98,1.55 43.96,1.58 X1.4 ; R20.1 49.93,5.65 C18.2 ; C16.1 v1(33.24,7.14) ; Q4.2 44.33,20.54 R21.1 ; C4.1 43.14,6.12 v1(43.46,6.12) v1(44.8,6.12) v1(46.48,6.12) 46.74,5.87 46.74,4.95 ; 46.74,4.95 46.73,4.94 X1.2 ; U3.2 37.47,20.48 37.72,20.73 C2.1 38.11,20.5 U3.1
  vias: v1(37.08,5.87) v1(37.1,4.91) v1(37.08,3.97) v1(38.23,5.87) v1(38.23,4.91) v1(38.23,3.97) v1(39.38,5.87) v1(39.38,4.91) v1(39.38,3.97) v1(43.35,1.55)
VCC: length 15.2
  Top Layer w0.201: U6.5 23.17,18.88 23.62,19.33 23.62,19.71 24.05,20.15 R11.2
  Top Layer w0.254: 15.29,10.57 C1.2 16.6,12.7 v1(16.03,13.27)
  Top Layer w0.5: v1(14.99,17.85) 15.52,18.38 C11.2 C10.2 20.39,18.88 U6.5
  vias: v1(9.91,13.49) v1(9.91,12.56) v1(9.91,11.64) v1(9.91,10.71) v1(9.91,9.93) v1(11.02,13.49) v1(11.02,12.56) v1(12.07,18.81) v1(12.07,17.88) v1(12.07,16.95) v1(12.07,16.03) v1(12.07,15.1) v1(12.07,14.18) v1(12.07,13.25) v1(12.98,16.05) v1(12.98,15.11) v1(12.98,14.2) v1(12.98,13.26) v1(13.11,18.81) v1(13.11,17.88) v1(13.11,16.95) v1(13.98,17.88) v1(13.98,16.95) v1(14.99,16.92) v1(16.03,16.05) v1(16.03,15.12) v1(16.03,14.21)
VCCIN+: length 30.4
  Top Layer w0.201: R1.1 34.16,14.78 v1(34.16,20.73) ; R6.2 23.11,8.46 23.11,11.08 22.23,11.97 Q1.2
  Top Layer w0.254: U3.4 36.83,17.41 36.83,15.14 36.45,14.76 R1.1
  Bottom Layer w0.201: v1(34.16,20.73) R7.2
VCCIN-: length 14
  Top Layer w0.201: R18.2 v1(51.18,6.38)
  Top Layer w0.254: U3.5 37.47,15.14 37.85,14.76 R1.2
  Inner1 w0.201: v1(51.18,6.38) 51.18,11.67 U4.1
VDDA: length 4.3
  Top Layer w0.201: U5.5 41.4,4.98 41.91,5.49 41.91,6.25 42.67,7.01 R15.2
AT32_RX: length 10.4
  Top Layer w0.201: U5.20 33.02,4.98 v1(32.77,4.73) ; U2.3 27.94,4.9 v1(27.94,3.46)
  Inner1 w0.201: v1(27.94,3.46) 27.94,4.35 28.32,4.73 v1(32.77,4.73)
AT32_SWCLK: length 6.9
  Top Layer w0.201: U5.24 34.58,2.98 34.15,3.41 32.95,3.41 32.74,3.21 30.98,3.21 30.45,3.74 U2.5
AT32_SWDIO: length 5.2
  Top Layer w0.201: U5.23 34.78,3.48 34.55,3.71 31.88,3.71 31.7,3.89 U2.6
AT32_TX: length 12.1
  Top Layer w0.201: v1(26.67,3.46) 26.67,4.88 U2.2 ; U5.19 v1(32.77,5.48)
  Inner1 w0.201: v1(26.67,3.46) 26.67,4.73 27.42,5.48 v1(32.77,5.48)
LCD_BLK: length 24.5
  Top Layer w0.201: U5.32 39.98,1.58 40.13,1.43 v1(40.64,1.43) ; R19.1 v1(45.59,17.88)
  Bottom Layer w0.201: v1(45.59,17.88) 45.59,1.17 45.34,0.92 41.15,0.92 v1(40.64,1.43)
LCD_CS: length 7.1
  Top Layer w0.201: U5.9 40.01,7.26 v1(40.01,8.79)
  Bottom Layer w0.201: v1(40.01,8.79) 40.01,9.81 38.86,10.95 U8.7
LCD_DC: length 5.7
  Top Layer w0.201: U5.10 39.5,7.25 v1(39.5,8.16)
  Bottom Layer w0.201: v1(39.5,8.16) 39.5,9.17 39.12,9.55 35.94,9.55 U8.5
LCD_RES: length 7.7
  Top Layer w0.201: v1(33.91,8.79) 36.45,8.79 36.98,8.27 U5.15
  Bottom Layer w0.201: v1(33.91,8.79) 33.91,10.06 34.1,10.25 U8.6
LCD_SCL: length 4.6
  Top Layer w0.201: U5.11 v1(38.98,8.79)
  Bottom Layer w0.201: v1(38.98,8.79) 36,8.79 U8.4
LCD_SDA: length 3
  Top Layer w0.201: U5.13 v1(37.98,8.16)
  Bottom Layer w0.201: v1(37.98,8.16) 37.97,8.15 U8.3
LEDK: length 7.7
  Top Layer w0.201: v1(38.73,15.78) 38.73,17.88 39.5,18.64 39.5,18.65
  Bottom Layer w0.201: v1(38.73,15.78) 38.73,14.25 38.23,13.74 35.95,13.74 U8.11
NRST: length 14.7
  Top Layer w0.201: v1(41.78,4.6) 41.66,4.48 U5.4
  Inner1 w0.201: v1(41.78,4.6) 39.37,2.19 35.81,2.19 34.75,1.12 v1(34.67,1.12)
  Bottom Layer w0.201: v1(34.67,1.12) R4.1 30.57,1.12 SW1.1
OSC_IN: length 5.8
  Top Layer w0.201: U5.2 42.31,3.48 C7.1 43.14,3.84 44.61,3.84 X1.1
OSC_OUT: length 3.6
  Top Layer w0.201: U5.3 42.08,3.98 C4.2 43.05,4.94 X1.3
PA1: length 15.8
  Top Layer w0.201: U5.7 41.4,5.98 41.54,6.12 v1(41.54,6.89) ; C18.1 51.17,4.56 R18.1 ; C18.1 48.38,4.56 D1.2 ; C18.1 v1(49.02,3.71)
  Inner1 w0.201: v1(41.54,6.89) 41.54,6.24 42.8,4.98 48.51,4.98 49.02,4.47 v1(49.02,3.71)
PA2: length 13.5
  Top Layer w0.201: U5.8 v1(40.73,7.65) ; U3.6 38.1,17.41 v1(38.1,16.28)
  Inner1 w0.201: v1(38.1,16.28) 40.51,16.28 40.73,16.07 v1(40.73,7.65)
PA15: length 29.2
  Top Layer w0.201: U5.25 v1(36.48,1.43)
  Bottom Layer w0.201: v1(36.48,1.43) 36.48,3.18 35.43,4.22 19.56,4.22 18.92,4.85 18.92,11.31 SW2.1 18.4,11.84 C6.2
PB2: length 13.3
  Top Layer w0.201: R8.1 v1(26.16,11.33) ; v1(33.02,8.66) 33.4,8.28 36.2,8.28 36.48,8 U5.16
  Bottom Layer w0.201: v1(33.02,8.66) 30.35,11.33 v1(26.16,11.33)
$1N3514: length 2.6
  Top Layer w0.5: C5.1 23.36,17.67 23.61,17.93 U6.1
$1N3518: length 5.8
  Top Layer w0.5: L1.1 25.81,15.68 22.58,15.68 22.23,16.03 U6.6
$1N3743: length 3
  Top Layer w0.2: 26.19,19.77 R14.2 ; 26.19,19.77 24.99,19.77 ; 26.19,19.77 R12.1
$1N4987: length 2
  Top Layer w0.201: R11.1 R13.2 22.28,19.88 U6.4
$1N9912: length 3.3
  Top Layer w0.254: R6.1 22.43,8.84 22.05,9.22 R10.2 21.18,9.2 Q3.1
$1N10537: length 7
  Top Layer w0.2: 14.44,10.58 14.44,10.1 14.73,9.81 17.4,9.81 17.69,10.1 C1.1
  Top Layer w0.254: R2.1 14.44,10.58 14.44,11.97 ; C1.1 R5.2
$1N10666: length 1.9
  Top Layer w0.254: R5.1 21.57,10.57 Q2.3
$1N10742: length 2.1
  Top Layer w0.2: Q2.1 25.25,9.61 R9.2 R8.2
$1N11033: length 1.2
  Bottom Layer w0.201: 47.8,20.73 49.03,20.73 LED1.2
$1N11315: length 14.7
  Top Layer w0.201: Q3.2 20.78,7.93 R10.1
  Bottom Layer w0.201: LED1.1 50.64,10.77 U4.2
$1N15037: length 2.4
  Top Layer w0.201: R21.2 R19.2 44.34,18.64 Q4.1
$1N15095: length 1.2
  Top Layer w0.201: Q4.3 40.6,19.51 R17.1
$1N30434: length 3.1
  Top Layer w0.201: R3.2 41.35,0.92 39.88,0.92 39.48,1.32 U5.31

## Copper pours and planes (outline as drawn; the poured copper is in the pictures)
VCC on Top Layer: 9.14,9.43 13.33,9.43 13.33,12.56 16.64,12.56 16.64,19.21 11.56,19.21 11.56,14.51 9.14,14.51
VCC on Bottom Layer: 9.14,9.43 13.33,9.43 13.33,12.56 16.64,12.56 16.64,19.21 11.56,19.21 11.56,14.51 9.14,14.51
VCCIN+ on Top Layer: 22.86,11.33 22.86,12.1 35.18,12.1 35.18,17.3 32,17.3 32,14 21.72,14 21.72,16.16 17.65,16.16 17.65,11.34 17.66,11.33
VCCIN- on Top Layer: 39.5,17.3 39.5,12.22 55.75,12.22 55.75,17.3
$1N11315 on Top Layer: 18.8,8.41 20.7,8.41 20.7,7.78 24.05,7.78 24.05,8.99 26.92,8.99 26.92,11.97 55.71,11.97 55.71,7.01 46.37,7.01 46.37,9.16 32.51,9.16 32.51,6 24.64,6 24.64,4.62 18.8,4.62

## Text on the board
Bottom Silkscreen Layer: VCC
